# Altium schematic sheet Jellyfish - LEDs & Buzzer.SchDoc
size A
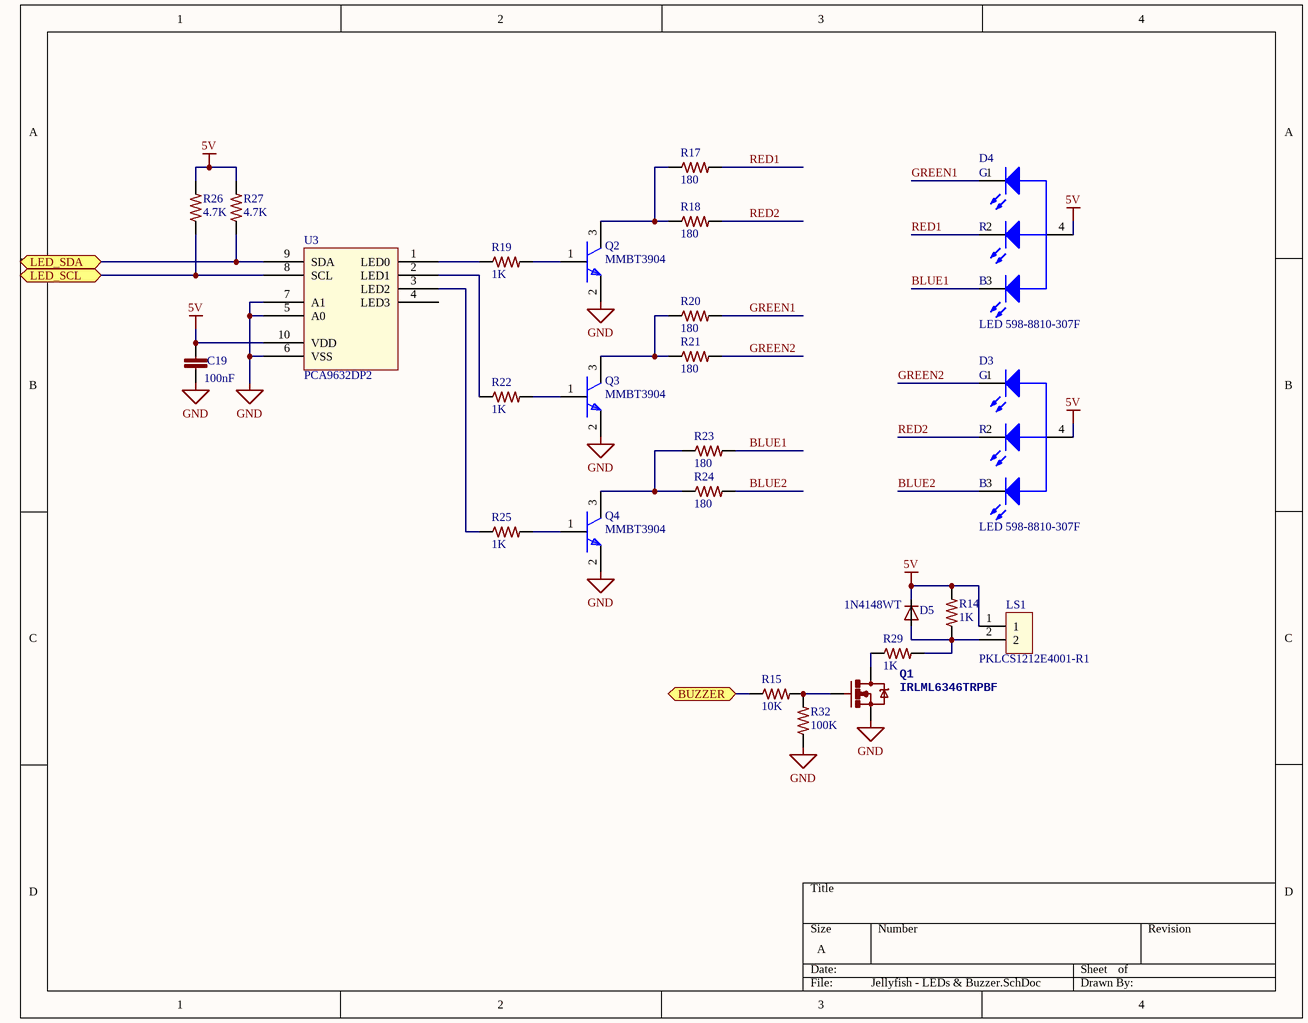
[diagram p0: Jellyfish - LEDs & Buzzer.SchDoc]

## Parts
C19  100nF  [C0402]
D3  LED 598-8810-307F  [LED SMD  598-8810-307F]
D4  LED 598-8810-307F  [LED SMD  598-8810-307F]
D5  1N4148WT  [SOD523]
LS1  PKLCS1212E4001-R1  [PKLCS1212E4001-R1]
Q1  IRLML6346TRPBF  [SOT23-3]
Q2  MMBT3904  [SOT23-3]
Q3  MMBT3904  [SOT23-3]
Q4  MMBT3904  [SOT23-3]
R14  1K  [R0603]
R15  10K  [R0603]
R17  180  [R0805]
R18  180  [R0805]
R19  1K  [R0603]
R20  180  [R0805]
R21  180  [R0805]
R22  1K  [R0603]
R23  180  [R0805]
R24  180  [R0805]
R25  1K  [R0603]
R26  4.7K  [R0603]
R27  4.7K  [R0603]
R29  1K  [R0603]
R32  100K  [R0603]
U3  PCA9632DP2  [IC TSSOP-10]

## Ports
BUZZER, LED_SCL, LED_SDA

## Nets
5V: C19.1 D3.4 D4.4 D5.C LS1.1 R14.2 R26.2 R27.2 U3.10(VDD)
GND: C19.2 Q1.2(S) Q2.2(E) Q3.2(E) Q4.2(E) R32.1 U3.5(A0) U3.6(VSS) U3.7(A1)
BLUE1: D4.3 R23.2
BLUE2: D3.3 R24.2
BUZZER: R15.1 ; port BUZZER
GREEN1: D4.1 R20.2
GREEN2: D3.1 R21.2
LED_SCL: R26.1 U3.8(SCL) ; port LED_SCL
LED_SDA: R27.1 U3.9(SDA) ; port LED_SDA
RED1: D4.2 R17.2
RED2: D3.2 R18.2
NetD5_A: D5.A LS1.2 R14.1 R29.2
NetQ1_1: Q1.1(G) R15.2 R32.2
NetQ1_3: Q1.3(D) R29.1
NetQ2_1: Q2.1(B) R19.2
NetQ2_3: Q2.3(C) R17.1 R18.1
NetQ3_1: Q3.1(B) R22.2
NetQ3_3: Q3.3(C) R20.1 R21.1
NetQ4_1: Q4.1(B) R25.2
NetQ4_3: Q4.3(C) R23.1 R24.1
NetR19_1: R19.1 U3.1(LED0)
NetR22_1: R22.1 U3.2(LED1)
NetR25_1: R25.1 U3.3(LED2)

Not connected (* = marked no-connect by the designer): U3 4(LED3)

## Notes on the sheet
- (in symbol LED 598-8810-307F) G; R; B

## Library data of the parts
C19 = GRM155R71C104KA88D: CAP CER 0402 100nF 16V 10% X7R; LastRevisionNote: ImportComponents; Published: 23-Apr-2014; Publisher: UltiMachine; LastRevisionDate: 23-Apr-2014; ManufacturerPartNumber: GRM155R71C104KA88D; VALUE: 100nF
D3 D4 = LED 598-8810-307F: LED MULTICOLOR RED/GRN/BLUE 1208; Mfg: DIALIGHT; Bestel grote: 1; Prijs: 2.26; Mfg code: 598-8810-307F; Faber itemcode: -; Supplier: Farnell; Supplier code: 1850760; Remarks: -; Value: -; Max soldering temp: -; SMD: Yes; Faber Artikelomschrijving: -
D5 = 1N4148WT: DIODE SOD523; LastRevisionNote: ImportComponents; Published: 23-Apr-2014; Publisher: UltiMachine; LastRevisionDate: 23-Apr-2014; Value: 1N4148WT
Q1 = IRLML6346TRPBF: Mosfet N-Channel 30V 3.4A 63mOhm; LastRevisionNote: ImportComponents; LastRevisionDate: 23-Apr-2014; ManufacturerPartNumber: IRLML6346TRPBF; Published: 23-Apr-2014; Publisher: UltiMachine
R14 R19 R22 R25 R29 = ERJ-3EKF1001V: RES 0603 1K 100mW 1%; LastRevisionNote: ImportComponents; Published: 23-Apr-2014; Publisher: UltiMachine; LastRevisionDate: 23-Apr-2014; ManufacturerPartNumber: ERJ-3EKF1001V; VALUE: 1K
R15 R26 R27 = ERJ-3EKF1002V: RES 0603 10K 100mW 1%; LastRevisionNote: ImportComponents; Published: 23-Apr-2014; Publisher: UltiMachine; LastRevisionDate: 23-Apr-2014; ManufacturerPartNumber: ERJ-3EKF1002V
  R15: VALUE: 10K
  R26 R27: VALUE: 4.7K
R17 R18 R20 R21 R23 R24 = CRCW0805180RJNEA: Resistor; LastRevisionNote: ImportComponents; Published: 23-Apr-2014; Publisher: UltiMachine; LastRevisionDate: 23-Apr-2014; VALUE: 180
R32 = RC0603FR-07100KL: RES 100K OHM 1/10W 1% 0603 SMD; LastRevisionNote: ImportComponents; Published: 23-Apr-2014; Publisher: UltiMachine; LastRevisionDate: 23-Apr-2014; ManufacturerPartNumber: RC0603FR-07100KL; VALUE: 100K
U3 = IC PCA9632: IC LED DRIVER RGBA; Faber ItemCode: 36966800; Mfg: NXP; Faber Artikelomschrijving: IC PCA9632DP2 TSSOP-10 NXP; Bestel grote: 1000; Prijs: 1,0876; Max soldering temp: -; Mfg code: PCA9632DP2; Remarks: -; SMD: Yes; Supplier: Digikey; Supplier code: 568-8254-6-ND; Value: -